# EAGLE board ESP32-P4 Display 7.0 inch V1.2 (EAGLE 9.6.2), part 1 of 3
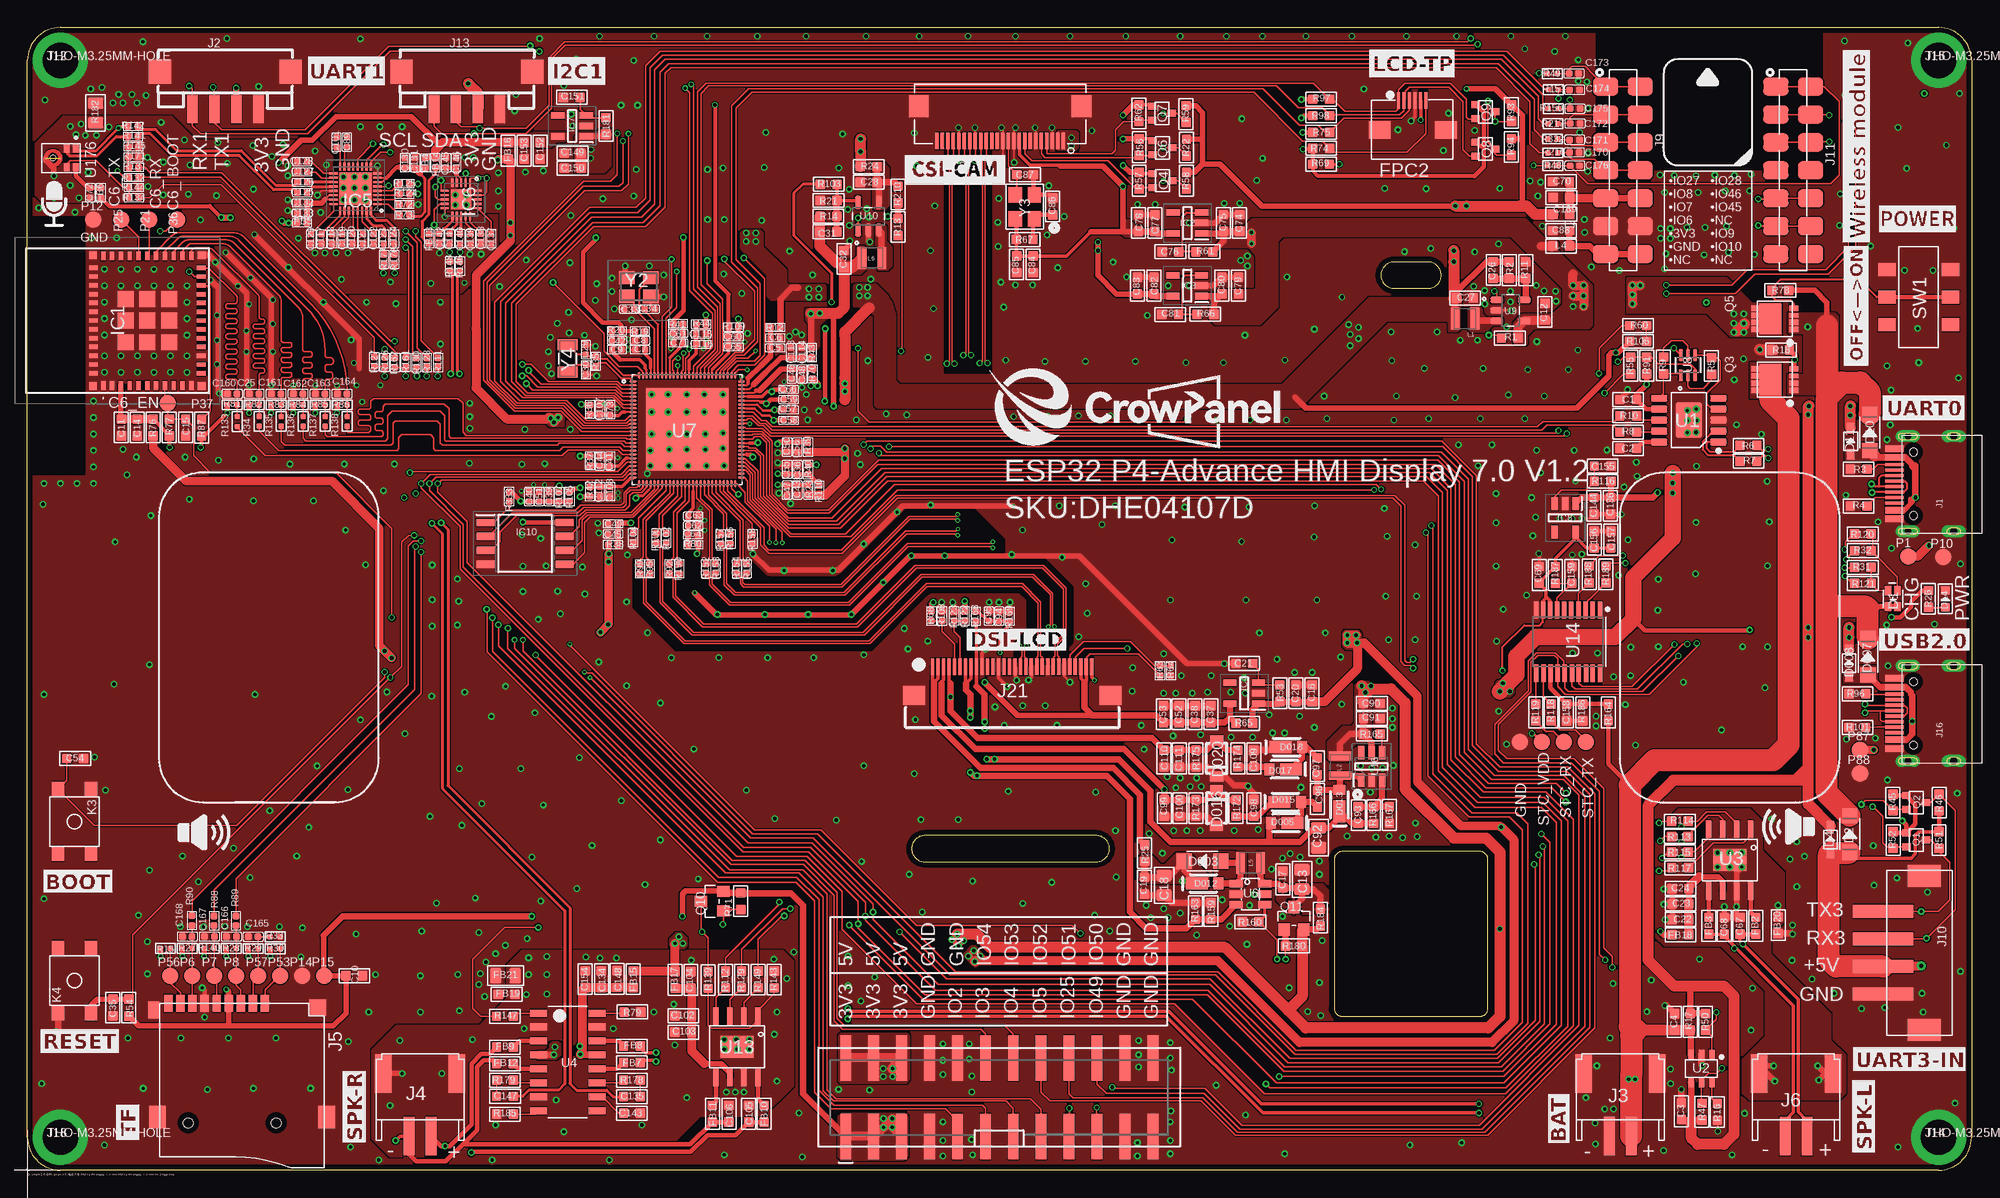
[diagram p9: board, top side]
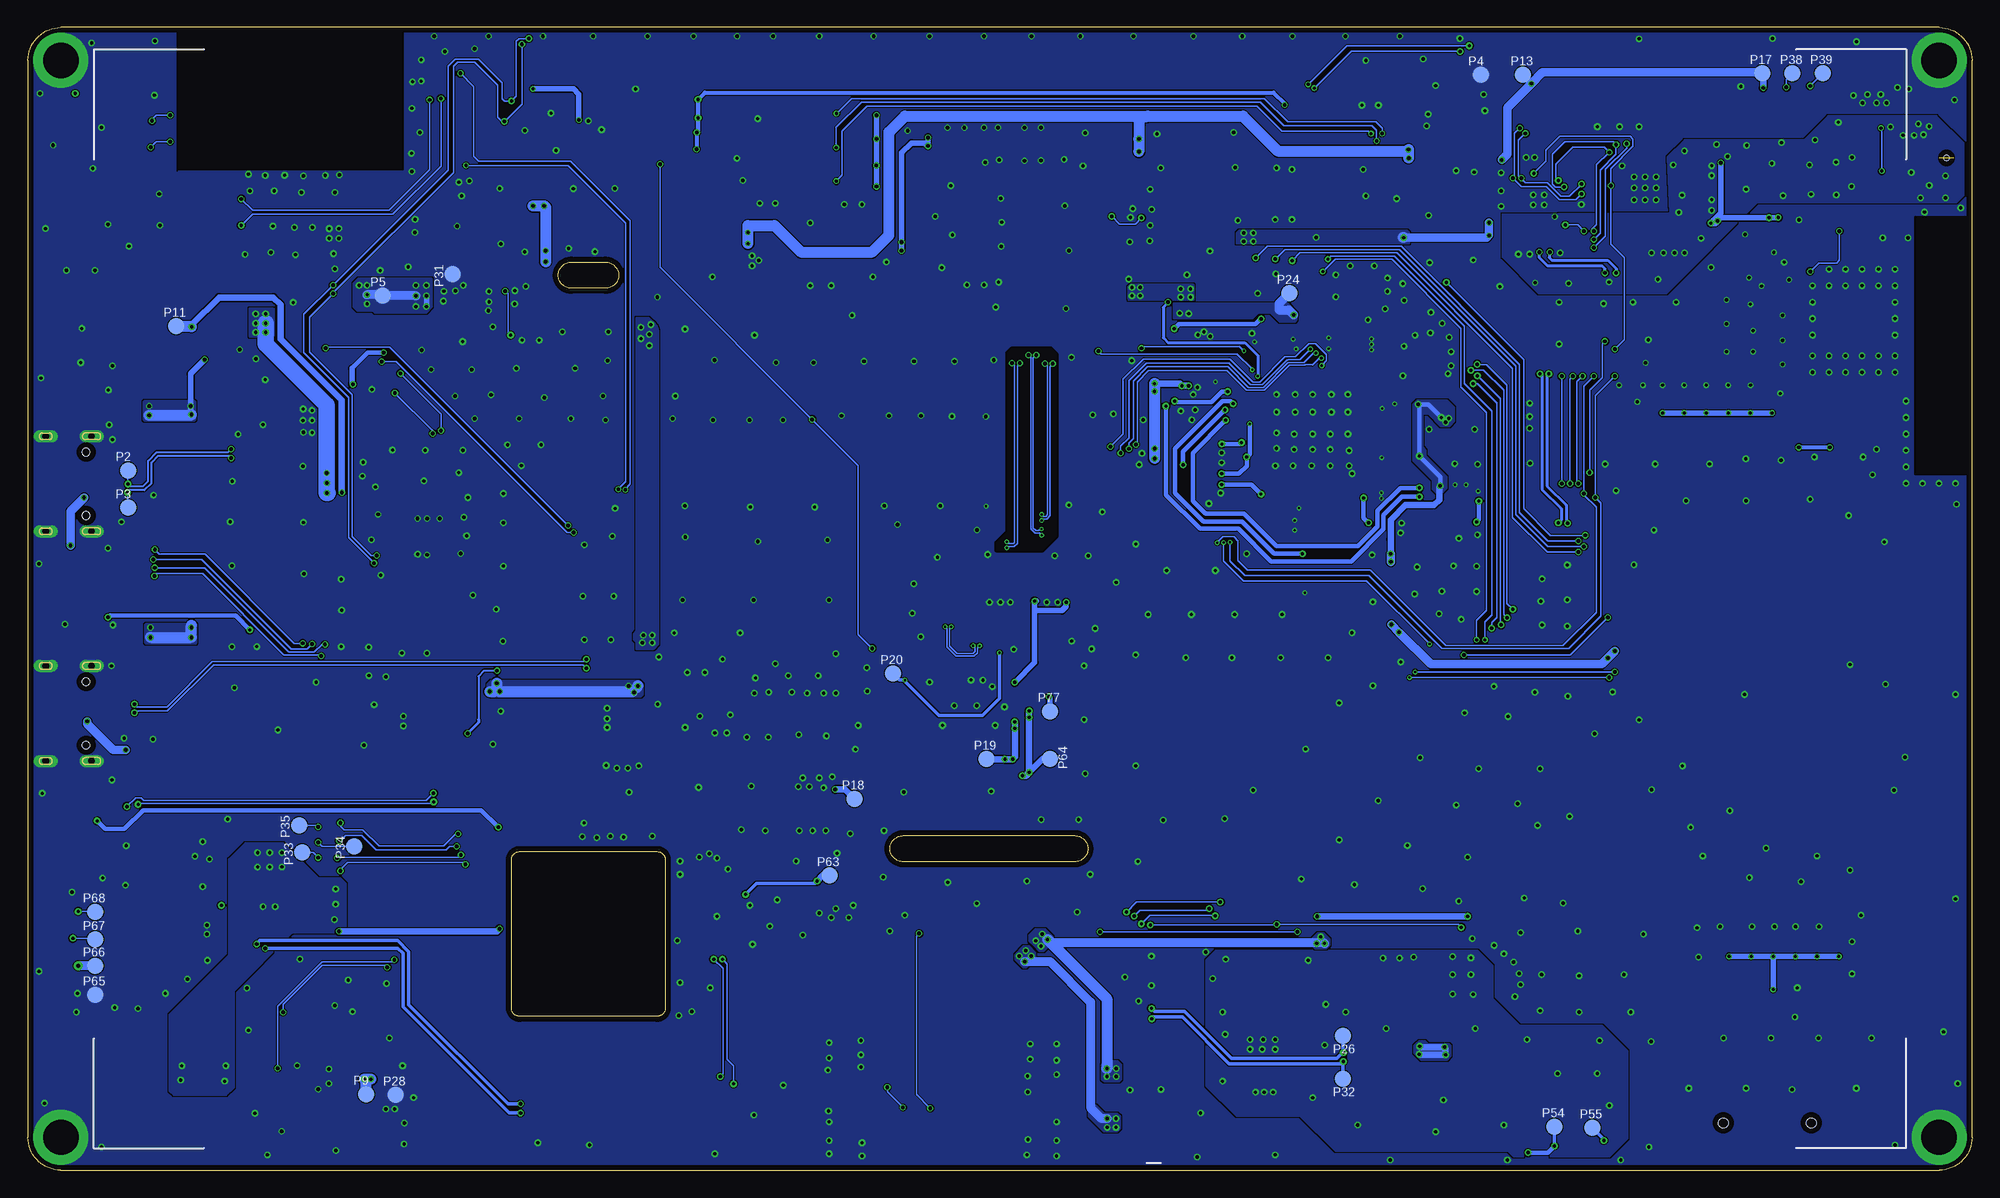
[diagram p10: board, bottom side, seen from below]

Size 176.9 x 104 mm. Coordinates in mm from the lower left corner, seen from the top.
Outline: 0,3 0,101 arc-90 3,104 173.9,104 arc-90 176.9,101 176.9,3 arc-90 173.9,0 3,0 arc-90 0,3
Outline: 81.64,28.07 97.27,28.07 arc180 97.27,30.45 81.64,30.45 arc180 81.64,28.07
Outline: 124.34,80.27 127.46,80.27 arc180 127.46,82.64 124.34,82.64 arc180 124.34,80.27
Outline: 119.65,14 132.15,14 arc90 132.9,14.75 132.9,28.25 arc90 132.15,29 119.65,29 arc90 118.9,28.25 118.9,14.75 arc90 119.65,14
Copper layers (1*16): Top 0.035mm / dielectric 1.5mm / Bottom 0.035mm
Design rules "default *": minimum track width 4mil, minimum drill 0.2mm, track to track 4mil, track to pad 6mil, pad to pad 6mil, via to via 6mil, smd to smd 6mil, copper to edge 20mil, drill to drill 6mil, minimum pad ring 10mil, minimum via ring 4mil, stop-mask expansion 4mil, vias tented up to drill 100mil, thermal gap 10mil

## Footprints (pad centres in the part's own frame; a part is rotated, then mirrored left to right if it is on the bottom)
0603 = smd 0.889 x 0.889: 1 -0.762,0; 2 0.762,0
C0402 = smd 0.6 x 0.6: 1 -0.45,0; 2 0.45,0
DISCRETE-NEW_C0603 = smd 0.889 x 0.889: 1 0,0.762; 2 0,-0.762
C0805 = smd 1.016 x 1.397: 1 -0.889,0; 2 0.889,0
C0402' = smd 0.635 x 0.635: 1 0,0.445; 2 0,-0.445
LED_KT-0603RYG = smd 0.85 x 0.6: 1 0.725,-0.425; 2 0.725,0.425; 3 -0.725,-0.425; 4 -0.725,0.425
D_SOD123FL = smd 1.397 x 1.397: + -1.651,0; - 1.651,0
D_SOD323 = smd 1 x 0.8: + -1.2,0; - 1.2,0
LMBR140ET1G = smd 2 x 1.1: 1 -0.975,0 | smd 0.9 x 1.1: 2 0.975,0
LED0603 = smd 0.762 x 0.889: + -0.762,0; - 0.762,0
LMSZ5233BT1G = smd 0.91 x 1.22: 1 -1.635,0; 2 1.635,0
L0603 = smd 0.889 x 0.889: 1 -0.762,0; 2 0.762,0
L0402 = smd 0.635 x 0.635: 1 -0.445,0; 2 0.445,0
R0402 = smd 0.635 x 0.635: 1 -0.445,0; 2 0.445,0
L0805 = smd 1.016 x 1.397: 1 -0.889,0; 2 0.889,0
FPC-6PIN-0.5MM = smd 0.3 x 1.5: 1 -1.31,2.184; 2 -0.81,2.184; 3 -0.31,2.184; 4 0.19,2.184; 5 0.69,2.184; 6 1.19,2.184 | smd 2 x 1.6: 7 -3.01,-0.496; 8 3.036,-0.496
FPC-SMD_P0.50-24P_QCHF-SM-H2.0 = smd 0.3 x 1.5: 1 5.75,-1.574; 2 5.25,-1.574; 3 4.75,-1.574; 4 4.25,-1.574; 5 3.75,-1.574; 6 3.25,-1.574; 7 2.75,-1.574; 8 2.25,-1.574; 9 1.75,-1.574; 10 1.25,-1.574; 11 0.75,-1.574; 12 0.25,-1.574; 13 -0.25,-1.574; 14 -0.75,-1.574; 15 -1.25,-1.574; 16 -1.75,-1.574; 17 -2.25,-1.574; 18 -2.75,-1.574; 19 -3.25,-1.574; 20 -3.75,-1.574; 21 -4.25,-1.574; 22 -4.75,-1.574; 23 -5.25,-1.574; 24 -5.75,-1.574 | smd 1.8 x 2: 25 7.4,1.576; 26 -7.4,1.576
ESP32C6MINI1N4 = smd 0.8 x 0.4: 1 -5.9,4; 2 -5.9,3.2; 3 -5.9,2.4; 4 -5.9,1.6; 5 -5.9,0.8; 6 -5.9,0; 7 -5.9,-0.8; 8 -5.9,-1.6; 9 -5.9,-2.4; 10 -5.9,-3.2; 11 -5.9,-4; 25 5.9,-4; 26 5.9,-3.2; 27 5.9,-2.4; 28 5.9,-1.6; 29 5.9,-0.8; 30 5.9,0; 31 5.9,0.8; 32 5.9,1.6; 33 5.9,2.4; 34 5.9,3.2; 35 5.9,4 | smd 0.4 x 0.8: 12 -4.8,-4.9; 13 -4,-4.9; 14 -3.2,-4.9; 15 -2.4,-4.9; 16 -1.6,-4.9; 17 -0.8,-4.9; 18 0,-4.9; 19 0.8,-4.9; 20 1.6,-4.9; 21 2.4,-4.9; 22 3.2,-4.9; 23 4,-4.9; 24 4.8,-4.9; 36 4.8,4.9; 37 4,4.9; 38 3.2,4.9; 39 2.4,4.9; 40 1.6,4.9; 41 0.8,4.9; 42 0,4.9; 43 -0.8,4.9; 44 -1.6,4.9; 45 -2.4,4.9; 46 -3.2,4.9; 47 -4,4.9; 48 -4.8,4.9 | smd 1.45 x 1.45: 49 0,0; 54 -1.975,1.975; 55 -1.975,0; 56 -1.975,-1.975; 57 0,-1.975; 58 1.975,-1.975; 59 1.975,0; 60 1.975,1.975; 61 0,1.975 | smd 0.7 x 0.7: 50 5.95,4.95; 51 5.95,-4.95; 52 -5.95,-4.95; 53 -5.95,4.95
SOT95P282X145-5N = smd 1.2 x 0.6: 1 -1.3,0.95; 2 -1.3,0; 3 -1.3,-0.95; 4 1.3,-0.95; 5 1.3,0.95
QFN40P400X400X80-33N = smd 0.75 x 0.2: 1 -2,1.4; 2 -2,1; 3 -2,0.6; 4 -2,0.2; 5 -2,-0.2; 6 -2,-0.6; 7 -2,-1; 8 -2,-1.4; 17 2,-1.4; 18 2,-1; 19 2,-0.6; 20 2,-0.2; 21 2,0.2; 22 2,0.6; 23 2,1; 24 2,1.4 | smd 0.2 x 0.75: 9 -1.4,-2; 10 -1,-2; 11 -0.6,-2; 12 -0.2,-2; 13 0.2,-2; 14 0.6,-2; 15 1,-2; 16 1.4,-2; 25 1.4,2; 26 1,2; 27 0.6,2; 28 0.2,2; 29 -0.2,2; 30 -0.6,2; 31 -1,2; 32 -1.4,2 | smd 2.9 x 2.9: 33 0,0
QFN40P300X300X60-21N = smd 0.75 x 0.2: 1 -1.5,0.8; 2 -1.5,0.4; 3 -1.5,0; 4 -1.5,-0.4; 5 -1.5,-0.8; 11 1.5,-0.8; 12 1.5,-0.4; 13 1.5,0; 14 1.5,0.4; 15 1.5,0.8 | smd 0.2 x 0.75: 6 -0.8,-1.5; 7 -0.4,-1.5; 8 0,-1.5; 9 0.4,-1.5; 10 0.8,-1.5; 16 0.8,1.5; 17 0.4,1.5; 18 0,1.5; 19 -0.4,1.5; 20 -0.8,1.5 | smd 1.8 x 1.8: 21 0,0
SOIC127P790X216-8N = smd 1.65 x 0.65: 1 -3.6,1.905; 2 -3.6,0.635; 3 -3.6,-0.635; 4 -3.6,-1.905; 5 3.6,-1.905; 6 3.6,-0.635; 7 3.6,0.635; 8 3.6,1.905
USB-3.0TYPEC-SMD = smd 0.3 x 1.7: A1 -3.35,0.5; A4 -2.55,0.5; A5 -1.25,0.5; A6 -0.25,0.5; A7 0.25,0.5; A8 1.25,0.5; A9 2.55,0.5; A12 3.35,0.5; B1 3.05,0.5; B4 2.25,0.5; B5 1.75,0.5; B6 0.75,0.5; B7 -0.75,0.5; B8 -1.75,0.5; B9 -2.25,0.5; B12 -3.05,0.5 | drill 0.6 pad 1.016 long: P$1 -4.325,-0.72; P$2 4.325,-0.72; P$3 -4.325,-4.9; P$4 4.325,-4.9 | hole 0.68: -2.89,-1.22; 2.89,-1.22
CONNECTOR_4P-SMD-2.0 = smd 0.965 x 2.54: 1 -3,0; 2 -1,0; 3 1,0; 4 3,0 | smd 2.032 x 2.184: SS1 -5.946,3.4; SS2 5.946,3.4
PH2.0WT-2PIN = smd 1 x 3.5: P$1 -1,0; P$2 1,0 | smd 1.5 x 3.5: P$3 -3.35,-5.7; P$4 3.35,-5.7
9P-SMD-W/-RING = smd 1.524 x 0.762: 1 0,4.4; 2 0,3.3; 3 0,2.2; 4 0,1.1; 5 0,0; 6 0,-1.1; 7 0,-2.2; 8 0,-3.3; 9 0,-4.4 | smd 1.524 x 1.016: G1 0.6,-5.746 | smd 2.032 x 1.524: G2 10.373,-5.4; G3 10.373,10 | smd 1.524 x 1.524: G4 0.392,9.181 | hole 0.889: 10.9,-2.6; 10.9,5.4
2X12-SMD1 = smd 4.14 x 0.991: 1 -3.569,13.97; 2 3.569,13.97; 3 -3.569,11.43; 4 3.569,11.43; 5 -3.569,8.89; 6 3.569,8.89; 7 -3.569,6.35; 8 3.569,6.35; 9 -3.569,3.81; 10 3.569,3.81; 11 -3.569,1.27; 12 3.569,1.27; 13 -3.569,-1.27; 14 3.569,-1.27; 15 -3.569,-3.81; 16 3.569,-3.81; 17 -3.569,-6.35; 18 3.569,-6.35; 19 -3.569,-8.89; 20 3.569,-8.89; 21 -3.569,-11.43; 22 3.569,-11.43; 23 -3.569,-13.97; 24 3.569,-13.97
TEST-PIN-4-2.0MM = smd 1.5 x 1.5: 1 -3,0; 2 -1,0; 3 1,0; 4 3,0
H7-2.54-18.28X2.5X5MM = smd 1.65 x 2.3: 1 -7.62,-1.58; 1-1 -7.62,1.58; 2 -5.08,-1.58; 2-2 -5.08,1.58; 3 -2.54,-1.58; 3-3 -2.54,1.58; 4 0,-1.58; 4-4 0,1.58; 5 2.54,-1.58; 5-5 2.54,1.58; 6 5.08,-1.58; 6-6 5.08,1.58; 7 7.62,-1.58; 7-7 7.62,1.58
XH2.54-4P-SMD = smd 1.2 x 5.5: 1 -3.75,-1.875; 2 -1.25,-1.875; 3 1.25,-1.875; 4 3.75,-1.875 | smd 2 x 3: 5 -7,1.875; 6 7,1.875
THO-M3.2*5MM-HOLE = drill 3.2 pad 5: P$1 0,0
C23398852_30P_0.5MM_下接_FC-05A30P11H20 = smd 0.3 x 1.5: 1 -7.25,1.3; 2 -6.75,1.3; 3 -6.25,1.3; 4 -5.75,1.3; 5 -5.25,1.3; 6 -4.75,1.3; 7 -4.25,1.3; 8 -3.75,1.3; 9 -3.25,1.3; 10 -2.75,1.3; 11 -2.25,1.3; 12 -1.75,1.3; 13 -1.25,1.3; 14 -0.75,1.3; 15 -0.25,1.3; 16 0.25,1.3; 17 0.75,1.3; 18 1.25,1.3; 19 1.75,1.3; 20 2.25,1.3; 21 2.75,1.3; 22 3.25,1.3; 23 3.75,1.3; 24 4.25,1.3; 25 4.75,1.3; 26 5.25,1.3; 27 5.75,1.3; 28 6.25,1.3; 29 6.75,1.3; 30 7.25,1.3 | smd 2 x 1.7: 31 8.95,-1.3; 32 -8.95,-1.3
KEY-4.5X4.5-SMD = smd 1.35 x 1.1: 1 -2.925,1.5; 2 -2.925,-1.5; 3 2.925,-1.5; 4 2.925,1.5
1008(2520) = smd 0.8 x 2: 1 -0.9,0; 2 0.9,0
TEST_PAD-1.5MM = smd 1.5 x 1.5: P$1 0,0
MOS_SOT323 = smd 0.635 x 0.762: 1 -0.635,-0.889; 2 0.635,-0.889; 3 0,0.889
PDFN3333 = smd 0.5 x 0.8: 1 -0.975,-1.725; 2 -0.325,-1.725; 4 0.975,-1.725; 5 0.975,1.725; 6 0.325,1.725; 7 -0.325,1.725; 8 -0.975,1.725 | smd 0.4 x 0.8: 3 0.325,-1.725 | smd 2.8 x 2: 9 0,0.4
PMOS_SOT23 = smd 1.016 x 1.143: 1 -0.889,-1.016; 2 0.889,-1.016; 3 0,1.016
R0603@1 = smd 0.889 x 0.889: 1 -0.762,0; 2 0.762,0
R0603 = smd 0.889 x 0.889: 1 -0.762,0; 2 0.762,0
0402 = smd 0.5 x 0.5: 1 -0.45,0; 2 0.45,0
R0603-SP = smd 0.889 x 0.889: 1 -0.762,0; 2 0.762,0
SWITCH_6PIN_2P = smd 1.2 x 1.6: 1 2.5,-2.9; 2 0,-2.9; 3 -2.5,-2.9; 4 -2.5,2.9; 5 0,2.9; 6 2.5,2.9
ESOP-10-EP-150MIL = smd 1.5 x 0.6: 1 -2.7,2; 2 -2.7,1; 3 -2.7,0; 4 -2.7,-1; 5 -2.7,-2; 6 2.7,-2; 7 2.7,-1; 8 2.7,0; 9 2.7,1; 10 2.7,2 | smd 2.4 x 3.2: EP 0,0
SOT23-6L = smd 0.5 x 0.9: 1 -0.961,-1.212; 2 -0.011,-1.212; 3 0.94,-1.212; 4 0.94,1.288; 5 -0.011,1.288; 6 -0.961,1.288
NS4168-ESOP-8 = smd 1.6 x 0.5: 1 -2.8,1.905; 2 -2.8,0.635; 3 -2.8,-0.635; 4 -2.8,-1.905; 5 2.8,-1.905; 6 2.8,-0.635; 7 2.8,0.635; 8 2.8,1.905 | smd 2 x 3: 9 0,0
SOP16 = smd 0.635 x 1.524: 1 0,0; 2 1.27,0; 3 2.54,0; 4 3.81,0; 5 5.08,0; 6 6.35,0; 7 7.62,0; 8 8.89,0; 9 8.89,5.334; 10 7.62,5.334; 11 6.35,5.334; 12 5.08,5.334; 13 3.81,5.334; 14 2.54,5.334; 15 1.27,5.334; 16 0,5.334
COOPER_SOT23-6 = smd 0.69 x 1.2: 1 -0.95,-1.3; 2 0,-1.3; 3 0.95,-1.3; 4 0.95,1.3; 5 0,1.3; 6 -0.95,1.3
IC_ESP32-P4NRW32 = smd 0.65 x 0.18: 1 -4.925,4.375; 2 -4.925,4.025; 3 -4.925,3.675; 4 -4.925,3.325; 5 -4.925,2.975; 6 -4.925,2.625; 7 -4.925,2.275; 8 -4.925,1.925; 9 -4.925,1.575; 10 -4.925,1.225; 11 -4.925,0.875; 12 -4.925,0.525; 13 -4.925,0.175; 14 -4.925,-0.175; 15 -4.925,-0.525; 16 -4.925,-0.875; 17 -4.925,-1.225; 18 -4.925,-1.575; 19 -4.925,-1.925; 20 -4.925,-2.275; 21 -4.925,-2.625; 22 -4.925,-2.975; 23 -4.925,-3.325; 24 -4.925,-3.675; 25 -4.925,-4.025; 26 -4.925,-4.375; 53 4.925,-4.375; 54 4.925,-4.025; 55 4.925,-3.675; 56 4.925,-3.325; 57 4.925,-2.975; 58 4.925,-2.625; 59 4.925,-2.275; 60 4.925,-1.925; 61 4.925,-1.575; 62 4.925,-1.225; 63 4.925,-0.875; 64 4.925,-0.525; 65 4.925,-0.175; 66 4.925,0.175; 67 4.925,0.525; 68 4.925,0.875; 69 4.925,1.225; 70 4.925,1.575; 71 4.925,1.925; 72 4.925,2.275; 73 4.925,2.625; 74 4.925,2.975; 75 4.925,3.325; 76 4.925,3.675; 77 4.925,4.025; 78 4.925,4.375 | smd 0.18 x 0.65: 27 -4.375,-4.925; 28 -4.025,-4.925; 29 -3.675,-4.925; 30 -3.325,-4.925; 31 -2.975,-4.925; 32 -2.625,-4.925; 33 -2.275,-4.925; 34 -1.925,-4.925; 35 -1.575,-4.925; 36 -1.225,-4.925; 37 -0.875,-4.925; 38 -0.525,-4.925; 39 -0.175,-4.925; 40 0.175,-4.925; 41 0.525,-4.925; 42 0.875,-4.925; 43 1.225,-4.925; 44 1.575,-4.925; 45 1.925,-4.925; 46 2.275,-4.925; 47 2.625,-4.925; 48 2.975,-4.925; 49 3.325,-4.925; 50 3.675,-4.925; 51 4.025,-4.925; 52 4.375,-4.925; 79 4.375,4.925; 80 4.025,4.925; 81 3.675,4.925; 82 3.325,4.925; 83 2.975,4.925; 84 2.625,4.925; 85 2.275,4.925; 86 1.925,4.925; 87 1.575,4.925; 88 1.225,4.925; 89 0.875,4.925; 90 0.525,4.925; 91 0.175,4.925; 92 -0.175,4.925; 93 -0.525,4.925; 94 -0.875,4.925; 95 -1.225,4.925; 96 -1.575,4.925; 97 -1.925,4.925; 98 -2.275,4.925; 99 -2.625,4.925; 100 -2.975,4.925; 101 -3.325,4.925; 102 -3.675,4.925; 103 -4.025,4.925; 104 -4.375,4.925 | smd 7.5 x 7.5: 105 0,0
SOP65P210X100-6N = smd 1.09 x 0.4: 1 -0.92,0.65; 2 -0.92,0; 3 -0.92,-0.65; 4 0.92,-0.65; 5 0.92,0; 6 0.92,0.65
SOT95P280X145-5N = smd 1.21 x 0.59: 1 -1.255,0.95; 2 -1.255,0; 3 -1.255,-0.95; 4 1.255,-0.95; 5 1.255,0.95
TSSOP20 = smd 1.572 x 0.41: 1 -2.872,2.275; 2 -2.872,1.625; 3 -2.872,0.975; 4 -2.872,0.325; 5 -2.872,-0.325; 6 -2.872,-0.975; 7 -2.872,-1.625; 8 -2.872,-2.275; 9 -2.872,-2.895; 10 -2.872,-3.545; 11 2.872,-3.515; 12 2.872,-2.865; 13 2.872,-2.215; 14 2.872,-1.565; 15 2.872,-0.915; 16 2.872,-0.265; 17 2.872,0.355; 18 2.872,1.005; 19 2.872,1.625; 20 2.872,2.275
SOT95P280X145-6N = smd 1.2 x 0.6: 1 -1.25,0.95; 2 -1.25,0; 3 -1.25,-0.95; 4 1.25,-0.95; 5 1.25,0; 6 1.25,0.95
MIC-SMD_5P-L3.5-W2.7-P1.67 = smd 0.725 x 0.522: 1 -0.838,1.362; 2 -0.838,0.542; 3 0.838,0.542; 4 0.838,1.362 | smd 0.25 x 0.25: 5_1 0,-0.048; 5_2 0,-1.373 | hole 0.5: 0,-0.71
X322540MPB4SI = smd 1.4 x 1.2: 1 -1.1,-0.85; 2 1.1,-0.85; 3 1.1,0.85; 4 -1.1,0.85
24MHZ_1631-24003-BTKEYA = smd 1.4 x 1.2: 1 -1.1,-0.875; 2 1.1,-0.875; 3 1.1,0.875; 4 -1.1,0.875
NORDIC_NRF_XTAL_3215_N = smd 1 x 1.8: 1 -1.25,0; 2 1.25,0

## Placement (x,y rotation side)
C1  1uF  [0603]  145.65,70.14 0 top
C2  1uF  [0603]  145.65,65.69 0 top
C3  1uF  [0603]  150.49,5.37 270 top
C4  10uF/NC  [0603]  149.86,13.51 270 top
C5  100nF  [C0402]  68.03,74.84 0 top
C6  10uF  [C0402]  68.05,75.75 180 top
C7  100nF  [C0402]  55.74,74.68 180 top
C8  10uF  [C0402]  55.74,75.51 0 top
C9  100nF  [C0402]  53.63,74.68 0 top
C10  1uF  [DISCRETE-NEW_C0603]  29.74,17.7 270 top
C11  100nF  [0603]  8.55,67.6 270 top
C12  10uF/10V+  [0603]  138.08,78.13 90 top
C13  22uF  [C0805]  115.97,26.46 90 top
C14  10uF  [0603]  9.98,67.6 90 top
C15  100nF  [0603]  14.4,67.6 270 top
C16  10uF  [0603]  116.89,43.4 270 top
C17  1uF  [0603]  114.22,26.46 270 top
C18  22uF  [C0805]  103.43,25.92 270 top
C19  100nF  [0603]  101.64,25.89 270 top
C20  100nF  [0603]  115.42,43.4 270 top
C21  100nF  [0603]  110.72,46.12 0 top
C22  1uF  [0603]  150.41,22.81 180 top
C23  47uF  [0603]  150.41,24.24 180 top
C24  47uF  [0603]  150.41,25.64 180 top
C25  10pF_NC  [C0402']  20.63,70.66 90 top
C26  22pF  [0603]  133.37,81.93 90 top
C27  10uF/10V+  [0603]  130.81,79.39 180 top
C28  10uF/10V+  [0603]  76.54,89.9 180 top
C29  12pF  [C0402]  50.81,74.68 90 top
C30  12pF  [C0402]  50.82,72.84 270 top
C31  22pF  [0603]  72.87,85.4 180 top
C32  10uF/10V+  [0603]  74.28,82.93 270 top
C33  15pF  [C0402]  54.76,78.36 180 top
C34  15pF  [C0402]  56.6,78.36 180 top
C35  100nF  [0603]  7.77,14.81 90 top
C36  100nF  [C0402]  70.06,63.78 90 top
C37  100nF  [0603]  107.68,41.5 270 top
C38  10uF  [0603]  106.24,41.5 270 top
C39  100nF_NC  [C0402]  47.46,61.3 90 top
C40  100nF  [C0402]  45.66,61.3 90 top
C41  100nF  [C0402]  53.03,64.55 90 top
C42  10uF  [C0402]  53.63,75.53 180 top
C43  100nF  [C0402]  70.06,61.9 270 top
C44  10uF  [C0402]  52.09,64.55 270 top
C45  100nF  [C0402]  53.28,57.91 180 top
C46  100nF  [C0402]  69.56,72.47 270 top
C47  10uF  [C0402]  69.12,61.9 90 top
C48  10uF  [C0402]  70.49,72.47 90 top
C49  10uF  [C0402]  53.28,58.82 0 top
C50  100nF  [C0402]  69.12,65.81 270 top
C51  1uF  [C0402]  46.56,61.3 90 top
C52  100nF  [0603]  104.8,41.5 270 top
C53  100nF  [0603]  103.36,41.5 270 top
C54  100nF  [0603]  4.34,37.47 180 top
C55  1uF  [C0402]  69.12,63.79 90 top
C56  10uF  [C0402]  70.06,65.81 90 top
C57  1uF  [C0402]  69.27,69.2 0 top
C58  1uF  [C0402]  69.27,68.25 0 top
C59  1uF  [C0402]  69.26,70.14 0 top
C60  100nF  [C0402]  64.24,75.85 0 top
C61  100nF  [C0402]  59.19,76.16 180 top
C62  10nF  [C0402]  60.57,58.66 0 top
C63  100nF  [C0402]  60.57,59.52 0 top
C64  1uF  [C0402]  60.56,57.82 0 top
C65  1uF  [C0402]  64.24,74.93 0 top
C66  1uF  [C0402]  69.26,71.06 0 top
C67  1nF  [0603]  155.82,22.25 270 top
C68  1nF  [0603]  154.4,22.25 270 top
C69  1uF  [0603]  137.55,54.18 270 top
C70  10UF  [0603]  139.53,89.97 180 top
C71  10uF  [C0402]  59.19,75.3 0 top
C72  100nF  [C0402]  5.71,88.95 90 top
C73  100nF  [C0402]  53.03,69.23 90 top
C74  10uF  [0603]  110.3,86.2 270 top
C75  100nF  [0603]  108.83,86.2 270 top
C76  100nF  [0603]  104.01,83.58 0 top
C77  100nF  [0603]  102.59,86.2 270 top
C78  10uF  [0603]  101.1,86.2 270 top
C79  10uF  [0603]  110.2,80.5 270 top
C80  100nF  [0603]  108.69,80.5 270 top
C81  100nF  [0603]  103.98,77.88 0 top
C82  100nF  [0603]  102.5,80.5 270 top
C83  10uF  [0603]  101,80.5 270 top
C84  100nF  [0603]  91.51,82.44 90 top
C85  1nF  [0603]  90.01,82.44 90 top
C86  1uF  [0603]  93.29,87.72 270 top
C87  15pF  [0603]  90.77,90.61 180 top
C88  10UF_NC  [0603]  139.55,85.52 180 top
C89  22pF_NC  [C0402]  29.07,93.56 90 top
C90  10uF/25V  [0603]  122.33,42.48 0 top
C91  100nF/50V  [0603]  122.33,41.11 0 top
C92  22uF/16V  [C0805]  117.48,30.26 270 top
C93  10nF/25V  [0603]  121.09,32.32 90 top
C94  10uF/25V  [C0402]  88.42,50.42 90 top
C95  100nF/50V  [C0402]  87.49,50.42 90 top
C96  1uF/25V  [0603]  117.38,33.8 270 top
C97  1uF/25V  [0603]  117.37,36.76 90 top
C98  1uF/50V  [0603]  111.59,32.96 90 top
C99  10uF/25V  [0603]  103.45,32.96 270 top
C100  100nF/50V  [0603]  104.87,32.96 270 top
C101  22pF_NC  [C0402]  28.12,93.56 90 top
C102  1uF  [0603]  59.67,14.06 180 top
C103  47uF  [0603]  59.67,12.56 180 top
C104  47uF  [0603]  60.36,17.33 90 top
C105  1nF  [0603]  65.62,5.15 270 top
C106  1nF  [0603]  63.83,5.15 270 top
C107  10uF  [C0402]  52.09,69.23 270 top
C108  100nF  [C0402]  53.03,61.77 270 top
C109  1uF/50V  [0603]  111.58,37.47 90 top
C110  10uF/25V  [0603]  103.41,37.47 270 top
C111  100nF/50V  [0603]  104.81,37.47 270 top
C112  10uF  [C0402]  52.09,61.77 90 top
C113  100nF  [C0402]  69.49,74.42 90 top
C114  10uF  [C0402]  70.43,74.42 270 top
C115  100nF  [C0402]  61.29,76.09 0 top
C116  10uF  [C0402]  61.3,75.17 180 top
C117  1uF_NC  [C0402]  26.76,84.76 90 top
C118  1uF_NC  [C0402]  27.71,84.76 90 top
C119  1uF_NC  [C0402]  28.65,84.76 90 top
C120  1uF_NC  [C0402]  29.6,84.76 90 top
C121  1uF_NC  [C0402]  30.54,84.76 90 top
C122  1uF_NC  [C0402]  31.49,84.76 90 top
C123  1uF_NC  [C0402]  32.43,84.76 90 top
C124  1uF_NC  [C0402]  33.38,84.76 90 top
C125  1uF_NC  [C0402]  25,88.96 180 top
C126  1uF_NC  [C0402]  25,89.91 180 top
C127  1uF_NC  [C0402]  25,90.85 180 top
C128  1uF_NC  [C0402]  25,91.8 180 top
C129  1uF_NC  [C0402]  25.81,84.76 270 top
C130  100nF_NC  [C0402]  34.35,91.7 90 top
C131  1uF_NC  [C0402]  35.28,91.68 270 top
C132  100nF_NC  [C0402]  24.99,88.03 180 top
C133  1uF_NC  [C0402]  24.98,87.12 0 top
C134  47uF_NC  [0603]  52.23,17.39 270 top
C135  100nF_NC  [0603]  55,6.7 0 top
C136  10uF  [0603]  144.05,60.46 90 top
C137  1uF_NC  [C0402]  42.21,84.77 90 top
C138  1uF_NC  [C0402]  41.26,84.78 270 top
C139  1uF_NC  [C0402]  40.31,84.78 270 top
C140  1uF_NC  [C0402]  39.37,84.78 270 top
C141  1uF_NC  [C0402]  38.42,84.78 270 top
C142  1uF_NC  [C0402]  37.48,84.78 270 top
C143  1uF_NC  [0603]  55,5.2 180 top
C144  100nF  [0603]  142.53,60.46 90 top
C145  100nF_NC  [C0402]  38.09,91.69 90 top
C146  1uF_NC  [C0402]  39.01,91.71 270 top
C147  100nF_NC  [0603]  43.45,6.72 180 top
C148  47uF_NC  [0603]  53.65,17.41 270 top
C149  10uF  [0603]  49.61,92.56 0 top
C150  100nF  [0603]  49.61,91.2 0 top
C151  100nF  [0603]  49.53,97.64 0 top
C152  100nF  [0603]  46.65,92.79 90 top
C153  10uF  [0603]  45.2,92.79 90 top
C154  100nF_NC  [0603]  50.75,17.39 90 top
C155  100nF  [0603]  143.33,64.09 180 top
C156  100nF  [0603]  142.56,57.39 270 top
C157  10uF  [0603]  144.08,57.39 270 top
C158  1nF  [0603]  140.04,41.66 90 top
C159  100nF  [0603]  140.52,54.18 270 top
C160  10pF_NC  [C0402']  18.63,70.66 90 top
C161  10pF_NC  [C0402']  22.63,70.66 90 top
C162  10pF_NC  [C0402']  24.63,70.66 90 top
C163  10pF_NC  [C0402']  26.63,70.66 90 top
C164  10pF_NC  [C0402']  28.63,70.66 90 top
C165  10pF_NC  [C0402']  20.54,21.24 90 top
C166  10pF_NC  [C0402']  18.55,21.26 90 top
C167  10pF_NC  [C0402']  16.55,21.25 90 top
C168  10pF_NC  [C0402']  14.54,21.26 90 top
C169  100nF  [0603]  139.57,88.52 180 top
C170  NC  [C0402']  140.75,92.63 270 top
C171  NC  [C0402']  140.79,93.79 270 top
C172  NC  [C0402']  140.81,95.28 270 top
C173  NC  [C0402']  140.72,99.82 270 top
C174  NC  [C0402']  140.79,98.33 270 top
C175  NC  [C0402']  140.81,96.61 270 top
C176  NC  [C0402']  140.8,91.42 270 top
D1  KT-0603RYG  [LED_KT-0603RYG]  169.74,52.03 270 top
D2  DSS34  [D_SOD123FL]  165.81,30.6 90 top
D003  NC/DSS34  [D_SOD123FL]  106.91,28.12 180 top
D4  1N5817WS  [D_SOD323]  164.06,30.09 90 top
D005  LMBR140ET1G  [LMBR140ET1G]  114.11,31.61 180 top
D007  DSS34  [D_SOD123FL]  167.47,46.72 90 top
D008  1N5817WS  [D_SOD323]  165.75,46.15 90 top
D10  DSS34  [D_SOD123FL]  167.63,67.14 90 top
D11  1N5817WS  [D_SOD323]  165.9,66.35 90 top
D012  LMBR140ET1G  [LMBR140ET1G]  107.41,26.09 0 top
D013  LMBR140ET1G  [LMBR140ET1G]  119.39,33.65 90 top
D14  Red  [LED0603]  174.52,52 90 top
D015  LMBR140ET1G  [LMBR140ET1G]  114.89,33.51 0 top
D016  MM1W18_18V  [LMSZ5233BT1G]  108.19,32.96 270 top
D017  LMBR140ET1G  [LMBR140ET1G]  113.99,36.49 180 top
D018  LMBR140ET1G  [LMBR140ET1G]  114.99,38.51 0 top
D020  LMSZ5233BT1G_-6V  [LMSZ5233BT1G]  108.21,37.47 90 top
FB2  1K/磁珠  [L0603]  157.27,22.25 270 top
FB3  1K/磁珠  [L0603]  152.99,22.25 270 top
FB4  0R/800mA_NC  [L0402]  36.21,91.67 270 top
FB5  0R/800mA_NC  [L0402]  24.97,86.21 0 top
FB6  0R/800mA  [L0402]  6.67,88.97 90 top
FB7  1K/磁珠_NC  [L0603]  55,9.8 0 top
FB8  1K/磁珠_NC  [L0603]  55,11.3 0 top
FB9  1K/磁珠_NC  [L0603]  43.45,11.2 180 top
FB10  1K/磁珠  [L0603]  67.02,5.15 270 top
FB11  1K/磁珠  [L0603]  62.33,5.15 270 top
FB12  1K/磁珠_NC  [L0603]  43.45,9.7 180 top
FB13  0R/800mA_NC  [L0402]  36.52,84.79 270 top
FB14  0R/800mA_NC  [R0402]  37.12,91.69 270 top
FB15  0R/800mA_NC  [L0603]  55.12,17.39 270 top
FB16  0R/800mA_NC  [L0603]  43.75,92.79 90 top
FB17  0R/800mA  [L0603]  58.93,17.33 90 top
FB18  0R/800mA  [L0603]  150.41,21.43 180 top
FB19  0R/800mA  [L0603]  43.6,16 0 top
FB20  0R/800mA  [L0603]  159.3,22.3 90 top
FB21  0R/800mA  [L0805]  43.5,17.7 0 top
FPC2  FPC-6PIN-0.5MM  [FPC-6PIN-0.5MM]  126.05,95.18 0 top
FPC3  AFC24-S24FIA-00  [FPC-SMD_P0.50-24P_QCHF-SM-H2.0]  88.5,95.24 0 top
IC1  ESP32-C6-MINI-1-N4  [ESP32C6MINI1N4]  10.91,77.32 90 top
IC2  ME6211C18M5G-N  [SOT95P282X145-5N]  105.55,86.2 180 top
IC3  ME6211C28M5G-N  [SOT95P282X145-5N]  105.54,80.5 180 top
IC4  ME6211C18M5G-N_NC  [SOT95P282X145-5N]  110.72,43.4 180 top
IC5  ES7210_NC  [QFN40P400X400X80-33N]  29.85,89.33 180 top
IC6  ES8311_NC  [QFN40P300X300X60-21N]  39.47,88.35 270 top
IC7  ME6211C33M5G-N  [SOT95P282X145-5N]  49.56,95.04 180 top
IC8  ME6211C33M5G-N  [SOT95P282X145-5N]  139.92,59.37 270 top
IC10  W25Q128JVSIQ  [SOIC127P790X216-8N]  45.28,57.05 0 top
J1  TYPEC-3.0-16P-SMD  [USB-3.0TYPEC-SMD]  170.38,62.47 90 top
J2  HY2.0-4P-SMT  [CONNECTOR_4P-SMD-2.0]  18,96.57 0 top
J3  PH2.0WT-2PIN  [PH2.0WT-2PIN]  144.93,3.11 180 top
J4  PH2.0WT-2PIN  [PH2.0WT-2PIN]  35.72,3.11 180 top
J5  [9P-SMD-W/-RING]  17.22,15.2 270 top
J6  PH2.0WT-2PIN  [PH2.0WT-2PIN]  160.93,3.11 180 top
J7  CONN_12X22X12-SMD1  [2X12-SMD1]  88.43,6.64 90 top
J8  HC-PZ200-8.7L-1X4PZ1  [TEST-PIN-4-2.0MM]  138.81,38.99 180 top
J9  [H7-2.54-18.28X2.5X5MM]  145.17,91 270 top
J10  XH2.54-4P-SMT  [XH2.54-4P-SMD]  170.73,19.8 270 top
J11  [H7-2.54-18.28X2.5X5MM]  160.67,91 270 top
J12  THO-M3.25MM-HOLE  [THO-M3.2*5MM-HOLE]  3,101 0 top
J13  HY2.0-4P-SMT  [CONNECTOR_4P-SMD-2.0]  40,96.57 0 top
J14  THO-M3.25MM-HOLE  [THO-M3.2*5MM-HOLE]  173.9,3 0 top
J15  THO-M3.25MM-HOLE  [THO-M3.2*5MM-HOLE]  173.9,101 0 top
J16  TYPEC-3.0-16P-SMD  [USB-3.0TYPEC-SMD]  170.38,41.57 90 top
J18  THO-M3.25MM-HOLE  [THO-M3.2*5MM-HOLE]  3,3 0 top
J21  C23398852_30P_0.5MM_下接_FC-05A30P11H20  [C23398852_30P_0.5MM_下接_FC-05A30P11H20]  89.6,44.51 0 top
K3  KEY-4.5X4.5  [KEY-4.5X4.5-SMD]  4.28,31.74 270 top
K4  KEY-4.5X4.5  [KEY-4.5X4.5-SMD]  4.28,17.25 90 top
L1  2.2μH_C5179446  [1008(2520)]  130.8,77.49 180 top
L2  4.7uH_C45385206_2.4A  [1008(2520)]  119.42,36.8 270 top
L3  0R  [L0603]  139.57,86.99 180 top
L4  NC  [L0603]  139.56,84.11 180 top
L5  4.7uH_C45385206_2.4A  [1008(2520)]  111.28,27.97 180 top
L6  2.2μH_C5179446  [1008(2520)]  76.83,83.03 180 top
P1  TEST_PADPAD-1.5MM  [TEST_PAD-1.5MM]  171.14,55.85 0 top
P2  TEST_PADPAD-1.5MM  [TEST_PAD-1.5MM]  167.78,63.69 0 bottom
P3  TEST_PADPAD-1.5MM  [TEST_PAD-1.5MM]  167.79,60.29 0 bottom
P4  TEST_PADPAD-1.5MM  [TEST_PAD-1.5MM]  44.7,99.69 0 bottom
P5  TEST_PADPAD-1.5MM  [TEST_PAD-1.5MM]  144.61,79.59 0 bottom
P6  TEST_PADPAD-1.5MM  [TEST_PAD-1.5MM]  15,17.7 0 top
P7  TEST_PADPAD-1.5MM  [TEST_PAD-1.5MM]  17,17.7 0 top
P8  TEST_PADPAD-1.5MM  [TEST_PAD-1.5MM]  19,17.7 0 top
P9  TEST_PADPAD-1.5MM  [TEST_PAD-1.5MM]  146.14,6.92 0 bottom
P10  TEST_PADPAD-1.5MM  [TEST_PAD-1.5MM]  174.31,55.79 0 top
P11  TEST_PADPAD-1.5MM  [TEST_PAD-1.5MM]  163.42,76.81 0 bottom
P12  TEST_PADPAD-1.5MM  [TEST_PAD-1.5MM]  6,86.5 0 top
P13  TEST_PADPAD-1.5MM  [TEST_PAD-1.5MM]  40.85,99.7 0 bottom
P14  TEST_PADPAD-1.5MM  [TEST_PAD-1.5MM]  25,17.7 0 top
P15  TEST_PADPAD-1.5MM  [TEST_PAD-1.5MM]  27,17.7 0 top
P17  TEST_PADPAD-1.5MM  [TEST_PAD-1.5MM]  19.08,99.82 0 bottom
P18  TEST_PADPAD-1.5MM  [TEST_PAD-1.5MM]  101.7,33.8 0 bottom
P19  TEST_PADPAD-1.5MM  [TEST_PAD-1.5MM]  89.68,37.41 0 bottom
P20  TEST_PADPAD-1.5MM  [TEST_PAD-1.5MM]  98.19,45.21 0 bottom
P21  TEST_PADPAD-1.5MM  [TEST_PAD-1.5MM]  11.08,86.5 90 top
P24  TEST_PADPAD-1.5MM  [TEST_PAD-1.5MM]  62.12,79.8 0 bottom
P25  TEST_PADPAD-1.5MM  [TEST_PAD-1.5MM]  8.54,86.5 90 top
P26  TEST_PADPAD-1.5MM  [TEST_PAD-1.5MM]  57.26,12.22 180 bottom
P28  TEST_PADPAD-1.5MM  [TEST_PAD-1.5MM]  143.44,6.85 0 bottom
P31  TEST_PADPAD-1.5MM  [TEST_PAD-1.5MM]  138.25,81.53 90 bottom
P32  TEST_PADPAD-1.5MM  [TEST_PAD-1.5MM]  57.27,8.32 180 bottom
P33  TEST_PADPAD-1.5MM  [TEST_PAD-1.5MM]  151.93,28.91 90 bottom
P34  TEST_PADPAD-1.5MM  [TEST_PAD-1.5MM]  147.22,29.49 90 bottom
P35  TEST_PADPAD-1.5MM  [TEST_PAD-1.5MM]  152.23,31.4 90 bottom
P36  TEST_PADPAD-1.5MM  [TEST_PAD-1.5MM]  13.62,86.5 0 top
P37  TEST_PADPAD-1.5MM  [TEST_PAD-1.5MM]  12.78,69.8 0 top
P38  TEST_PADPAD-1.5MM  [TEST_PAD-1.5MM]  16.33,99.82 0 bottom
P39  TEST_PADPAD-1.5MM  [TEST_PAD-1.5MM]  13.59,99.82 0 bottom
P53  TEST_PADPAD-1.5MM  [TEST_PAD-1.5MM]  23,17.7 0 top
P54  TEST_PADPAD-1.5MM  [TEST_PAD-1.5MM]  38,3.97 0 bottom
P55  TEST_PADPAD-1.5MM  [TEST_PAD-1.5MM]  34.56,3.86 0 bottom
P56  TEST_PADPAD-1.5MM  [TEST_PAD-1.5MM]  13,17.7 0 top
P57  TEST_PADPAD-1.5MM  [TEST_PAD-1.5MM]  21,17.7 0 top
P63  TEST_PADPAD-1.5MM  [TEST_PAD-1.5MM]  103.96,26.82 0 bottom
P64  TEST_PADPAD-1.5MM  [TEST_PAD-1.5MM]  83.92,37.43 270 bottom
P65  TEST_PADPAD-1.5MM  [TEST_PAD-1.5MM]  170.76,15.96 0 bottom
P66  TEST_PADPAD-1.5MM  [TEST_PAD-1.5MM]  170.76,18.6 0 bottom
P67  TEST_PADPAD-1.5MM  [TEST_PAD-1.5MM]  170.76,21 0 bottom
P68  TEST_PADPAD-1.5MM  [TEST_PAD-1.5MM]  170.76,23.52 0 bottom
P77  TEST_PADPAD-1.5MM  [TEST_PAD-1.5MM]  83.88,41.76 0 bottom
P87  TEST_PADPAD-1.5MM  [TEST_PAD-1.5MM]  166.75,38.26 0 top
P88  TEST_PADPAD-1.5MM  [TEST_PAD-1.5MM]  166.75,36.1 0 top
Q1  BSS138W_SOT323  [MOS_SOT323]  171.86,30.05 270 top
Q2  BSS138W_SOT323  [MOS_SOT323]  171.86,33.45 270 top
Q3  NCE20P45Q  [PDFN3333]  158.99,71.95 90 top
Q4  BSS138W_SOT323  [MOS_SOT323]  103.26,90.05 270 top
Q5  NCE20P45Q  [PDFN3333]  158.99,77.48 90 top
Q6  BSS138W_SOT323  [MOS_SOT323]  103.26,93.05 270 top
Q7  BSS138W_SOT323  [MOS_SOT323]  103.24,96.19 270 top
Q8  BSS138W_SOT323  [MOS_SOT323]  132.65,92.93 270 top
Q9  BSS138W_SOT323  [MOS_SOT323]  132.65,96.32 270 top
Q10  AO3401  [PMOS_SOT23]  62.31,24.48 90 top
Q11  AO3401_NC  [PMOS_SOT23]  115.24,22.93 0 top
R1  10K  [R0603@1]  134.88,75.74 0 top
R2  100K  [R0603@1]  134.83,81.92 270 top
R3  5.1K  [R0603@1]  166.62,63.81 0 top
R4  5.1K  [R0603@1]  166.62,60.45 180 top
R5  10K  [R0603@1]  153.23,73.2 90 top
R6  0R  [R0603@1]  156.6,65.96 0 top
R7  0R  [R0603@1]  156.6,64.53 0 top
R8  0R  [R0603@1]  145.65,67.19 0 top
R9  10K  [R0603@1]  148.87,73.25 270 top
R10  0R  [R0603@1]  145.65,68.66 0 top
R11  22.1K  [R0603]  136.33,81.92 90 top
R12  0R  [R0402]  68.06,76.7 0 top
R13  0R  [R0603@1]  79.21,85.84 270 top
R14  NC/499K  [R0603]  72.87,86.82 0 top
R15  10K  [0402]  12.56,20.17 180 top
R16  2K  [R0603-SP]  153.76,5.3 90 top
R17  5.1K  [R0603@1]  151.3,13.51 90 top
R18  10K  [R0603@1]  159.56,74.65 0 top
R19  0R  [R0402]  55.73,76.36 180 top
R20  0R  [R0402]  53.62,76.38 0 top
R21  NC/499K  [R0603]  72.89,88.26 180 top
R22  4.7K  [R0603@1]  105.45,93.08 270 top
R23  0R  [C0402]  71.05,61.9 270 top
R24  0R  [R0603@1]  76.55,91.34 180 top
R25  0R  [R0603-SP]  101.65,28.87 90 top
R26  5.1K  [R0603@1]  172.97,52 90 top
R27  10K  [0402]  14.54,20.18 180 top
R28  10K  [0402]  18.53,20.17 180 top
R29  10K  [0402]  20.54,20.17 180 top
R30  10K  [0402]  22.53,20.16 180 top
R31  2K  [R0603-SP]  167,54.86 180 top
R32  2K  [R0603-SP]  167,56.39 180 top
R33  10K_NC  [0402]  22.54,21.25 0 top
R34  22R  [0402]  21.07,68.16 90 top
R35  NC/10M  [R0402]  51.71,73.62 90 top
R36  0R  [R0402]  51.18,69.23 90 top
R37  0R  [R0402]  51.18,64.55 90 top
R38  0R  [R0402]  53.28,56.94 180 top
R39  0R  [R0402]  71.02,65.81 270 top
R40  0R  [R0402]  71.03,63.77 90 top
R41  0R  [R0402]  59.19,77.04 180 top
R42  0R  [R0402]  51.18,61.77 270 top
R43  0R  [R0402]  71.37,74.42 90 top
R44  0R  [R0402]  61.29,77 0 top
R45  4.7K  [R0603@1]  169.75,33.45 270 top
R46  4.7K  [R0603@1]  173.95,33.45 90 top
R47  5.1K  [R0603@1]  152.37,5.32 270 top
R48  22R  [0402]  138.81,91.44 180 top
R49  22R  [0402]  138.75,99.8 180 top
R50  5.1K  [R0603@1]  152.69,13.51 90 top
R51  4.7K  [R0603@1]  173.94,30.05 270 top
R52  4.7K  [R0603@1]  169.76,30.05 270 top
R53  10K  [R0603@1]  113.96,43.4 270 top
R54  10K  [R0603@1]  9.22,14.8 90 top
R55  0R  [R0603@1]  145.88,73.23 270 top
R56  4.7K  [R0603@1]  101.16,93.1 270 top
R57  4.7K  [R0603@1]  101.16,90.05 270 top
R58  4.7K  [R0603@1]  105.45,90.06 270 top
R59  4.7K  [R0603@1]  105.43,96.12 270 top
R60  0R  [R0603@1]  146.55,76.86 180 top
R61  10K  [R0603@1]  107.09,83.59 0 top
R62  4.7K  [R0603@1]  101.14,96.19 270 top
R63  100K  [R0402]  103.06,45.47 270 top
R64  100K  [R0402]  104.05,45.47 90 top
R65  0R  [R0603@1]  110.72,40.67 0 top
R66  10K  [R0603@1]  107.18,77.89 0 top
R67  10K  [R0603@1]  90.74,84.71 180 top
R68  100K  [R0402]  82.26,50.43 90 top
R69  2K  [R0603-SP]  117.71,91.56 0 top
R70  0R  [R0402]  71.45,72.47 270 top
R71  10K  [R0603@1]  64.9,24.48 90 top
R72  10K_NC  [R0402]  34.3,87.89 180 top
R73  10K_NC  [R0402]  34.3,86.94 180 top
R74  2K  [R0603@1]  117.72,93 0 top
R75  2K_NC  [R0603@1]  117.72,94.45 0 top
R76  0R  [R0603@1]  11.43,67.6 270 top
R77  10K  [R0603@1]  12.91,67.6 270 top
R78  4.7K  [R0603@1]  159.49,80.07 0 top
R79  OR_NC  [R0603-SP]  55.05,14.4 0 top
R80  0R  [R0402]  60.58,56.92 0 top
R81  51K  [0402]  18.63,69.66 0 top
R82  51K  [0402]  20.63,69.66 0 top
R83  51K  [0402]  22.63,69.66 0 top
R84  51K  [0402]  24.63,69.66 0 top
R85  51K  [0402]  26.63,69.66 0 top
R86  51K  [0402]  28.63,69.66 0 top
R87  10K  [R0603@1]  15.85,67.58 90 top
R88  0R  [R0402]  16.99,22.69 90 top
R89  0R  [R0402]  18.98,22.7 90 top
R90  0R  [R0402]  14.97,22.71 90 top
R91  10K  [R0603@1]  147.34,73.23 90 top
R92  0R  [R0402]  58.42,54.73 90 top
R93  2K  [R0603@1]  135.04,96.21 270 top
R94  2K  [R0603@1]  135.03,93.12 270 top
R95  0R  [R0402]  56.62,54.73 90 top
R96  5.1K  [R0603@1]  166.51,43.36 0 top
R97  2K  [R0603@1]  117.72,97.47 0 top
R98  2K  [R0603@1]  117.72,95.97 0 top
R99  0R  [R0402]  55.72,54.72 90 top
R100  0R  [R0402]  57.22,57.53 90 top
R101  5.1K  [R0603@1]  166.51,40.29 180 top
R102  0R  [R0402]  58.12,57.53 90 top
R103  0R  [R0603@1]  72.91,89.73 180 top
R104  4.02K  [R0402]  55.12,57.56 90 top
R105  0R  [R0402]  49.32,61.3 90 top
R106  10K  [R0603@1]  146.55,75.43 0 top
R107  0R_NC  [R0402]  48.37,61.3 90 top
R108  100K  [R0402]  83.23,50.43 270 top
R109  0R  [R0402]  64.24,76.72 0 top
R110  0R_NC  [R0402]  72.04,61.89 270 top
R111  0R_NC  [R0402]  37.36,73.5 90 top
R112  22R  [R0603@1]  63.52,17.36 270 top
R113  22R  [R0603@1]  150.36,30.36 0 top
R114  22R  [R0603@1]  150.36,31.76 0 top
R115  22R  [R0603@1]  150.36,28.96 0 top
R116  10K  [R0603@1]  143.34,62.7 0 top
R117  100K  [R0603@1]  150.38,27.53 180 top
R118  0R  [R0603@1]  138.64,41.66 90 top
R119  0R  [R0603@1]  137.24,41.66 90 top
R120  5.1K_NC  [R0603@1]  167,57.91 180 top
R121  5.1K_NC  [R0603@1]  167.01,53.41 180 top
R122  100K  [R0402]  85.28,50.43 90 top
R123  100K  [R0402]  84.31,50.43 270 top
R124  0R_NC  [R0402]  34.3,88.83 180 top
R125  0R_NC  [R0402]  34.3,89.78 180 top
R126  0R_NC  [R0402]  32.51,73.53 90 top
R127  22R  [R0402]  31.55,73.58 90 top
R128  0R_NC  [R0402]  36.35,73.5 90 top
R129  22R  [R0603@1]  64.98,17.36 270 top
R130  0R_NC  [R0402]  35.4,73.5 90 top
R131  10K  [R0402]  9.66,91.27 0 top
R132  OR  [R0402]  9.68,90.36 180 top
R133  22R  [0402]  19.08,68.12 90 top
R134  OR  [R0402]  9.68,88.52 0 top
R135  22R  [0402]  23.08,68.15 90 top
R136  22R  [0402]  25.07,68.15 90 top
R137  22R  [0402]  27.09,68.15 90 top
R138  22R  [0402]  29.08,68.15 90 top
R139  100K  [R0603@1]  61.93,17.31 90 top
R140  10K  [0402]  16.53,20.18 180 top
R141  OR_NC  [R0402]  9.61,94.07 0 top
R142  OR_NC  [R0402]  9.61,95 0 top
R143  51K  [R0603-SP]  67.95,17.36 270 top
R144  OR_NC  [R0402]  9.68,89.44 180 top
R145  OR_NC  [R0402]  9.63,93.14 0 top
R146  0R_NC  [R0402]  39.36,82.28 270 top
R147  OR_NC  [R0603-SP]  43.45,14 0 top
R148  0R_NC  [R0402]  38.44,82.28 270 top
R149  22R  [R0603@1]  66.49,17.36 270 top
R150  0R  [0402]  138.84,96.6 0 top
R151  0R  [0402]  138.84,98.32 0 top
R152  100R  [R0402]  61.76,54.75 270 top
R153  100R  [R0402]  62.61,54.75 270 top
R154  100R  [R0402]  64.54,54.75 270 top
R155  100R  [R0402]  65.42,54.75 270 top
R156  100R  [R0402]  63.97,57.45 270 top
R157  100R  [R0402]  63.07,57.45 270 top
R158  4.02K  [R0402]  65.97,57.45 270 top
R159  1.1R  [R0603-SP]  107.68,23.59 270 top
R160  10K  [R0603@1]  111.28,22.62 180 top
R161  0R_NC  [R0402]  34.42,73.52 90 top
R162  22R  [R0402]  33.45,73.51 90 top
R163  NC  [R0603-SP]  106.28,23.59 270 top
R164  39k  [R0603@1]  143.85,41.66 90 top
R165  100K  [R0603@1]  122.33,39.69 0 top
R166  180K  [R0603]  122.49,32.32 270 top
R167  12K  [R0603]  123.93,32.33 90 top
R168  1.91K  [R0402]  86.28,50.42 270 top
R169  1K  [R0402]  89.38,50.42 270 top
R170  0R_NC  [R0402]  33.39,82.89 90 top
R171  10K  [R0402]  9.63,92.21 0 top
R172  220R  [R0603]  109.98,32.96 270 top
R173  51K  [R0603@1]  106.32,32.96 90 top
R174  220R  [R0603]  110.13,37.47 270 top
R175  51K  [R0603@1]  106.32,37.47 90 top
R177  0R_NC  [R0402]  32.43,82.9 90 top
R178  20K_NC  [R0603]  55,8.2 0 top
R179  20K_NC  [R0603]  43.45,8.2 180 top
R180  10K  [R0603@1]  115.24,20.4 0 top
R181  10K  [R0603@1]  52.64,95.03 270 top
R182  0R  [L0805]  6.21,96.22 270 top
R184  0R  [R0603@1]  117.64,22.99 90 top
R185  OR_NC  [R0603-SP]  43.45,5.1 0 top
R186  100k  [R0603@1]  141.52,41.66 270 top
R187  10k  [R0603@1]  139.02,54.18 270 top
R188  0R  [R0603@1]  142.11,54.23 270 top
R189  0R  [R0603@1]  143.64,54.23 270 top
R190  0R  [R0402]  59.31,54.73 90 top
R210  NC/10K  [R0603@1]  79.22,88.8 270 top
R216  0R  [0402]  138.79,92.58 0 top
R217  0R  [0402]  138.81,95.24 0 top
R332  0R  [0402]  138.79,93.85 0 top
R333  10K  [R0402]  43.83,61.3 90 top
SW1  switch_6pin  [SWITCH_6PIN_2P]  172.09,79.45 90 top
U1  CH340K  [ESOP-10-EP-150MIL]  151.17,68.27 180 top
U2  TP4059-SOT23-6  [SOT23-6L]  152.32,9.3 180 top
U3  NS4168  [NS4168-ESOP-8]  154.89,28.22 270 top
U4  NS4263B  [SOP16]  46.5,14.3 270 top
U6  MT9201  [COOPER_SOT23-6]  111.28,25.13 270 top
U7  ESP32-P4NRW32  [IC_ESP32-P4NRW32]  60.03,67.41 0 top
U8  UMH3NTN  [SOP65P210X100-6N]  151.09,73.27 90 top
U9  MT3406_C22462728  [SOT95P280X145-5N]  134.94,78.26 0 top
U10  MT3406_C22462728  [SOT95P280X145-5N]  76.51,86.82 90 top
U13  NS4168  [NS4168-ESOP-8]  64.56,11.22 270 top
U14  STC8H1K08-36I  [TSSOP20]  140.81,48.1 270 top
U16  MT3608  [SOT95P280X145-6N]  122.3,36.75 90 top
U176  LMA3526B381  [MIC-SMD_5P-L3.5-W2.7-P1.67]  3.04,92.12 270 top
U$113  [P4-LCD-7.0-BK3]  0,0 0 top
Y2  40MHZ  [X322540MPB4SI]  55.63,80.37 0 top
Y3  24Mhz  [24MHZ_1631-24003-BTKEYA]  90.76,87.67 90 top
Y4  32.768K  [NORDIC_NRF_XTAL_3215_N]  49.15,73.87 270 top

## Tracks (layer width: path | path; a pad name or v marks a point on that pad's centre or on a via)
3V3$
  Top 0.406: C2.2 146.99,66.27 U1.10
13
  Top 0.12: R189.2 142.14,51.97 141.78,51.62 U14.3
14
  Top 0.12: U14.4 141.13,52.48 R188.2
+5V_IN  (via drill 0.4 pad 0.8)
  Top 0.305: R51.1 172.11,30.81 171.8,30.5 171.8,28.8 171.4,28.4 166.26,28.4 165.76,28.89
  Top 0.406: R46.1 R51.1
  Top 0.813: J10.3 168.9,18.6 v172.32,18.6
  Top 2: J10.3 164.55,18.55 163.93,19.17 163.93,28.76 D4.+ 165.76,28.89 D2.+
  Bottom 0.813: P66.P$1 v172.32,18.6
+VBUS1  (via drill 0.35)
  Top 0.305: J1.B4 168.38,64.72 168.1,65 | 168,65.1 168.08,65.02 J1.A9 170.91,65.02 171.72,64.22 | J1.B4 | J1.B4 170.81,64.72 171.32,64.22 171.47,64.22 171.72,64.22 | J1.B9 170.82,60.22 171.26,60.67 171.26,61.13 171.4,60.99 171.43,60.96 171.59,60.8 170.71,59.92 J1.A4 | 171.72,64.22 171.8,64.13
  Top 0.508: 171.8,63.76 171.47,64.09 171.47,64.22
  Top 0.61: 171.8,64.13 171.8,63.76 v171.8,61.22 171.69,61.22 171.43,60.96
  Top 0.762: v173.02,56.84 172.03,55.85 P1.P$1
  Top 1: 168,65.1 168.1,65
  Bottom 0.762: v171.8,61.22 173.02,59.99 v173.02,56.84
  pour Top (no thermals): 165.49,64.61 168.28,64.61 168.48,64.8 168.48,66.04 168.35,66.17 165.55,66.17 165.42,66.04 165.36,65.97 165.36,64.67 165.42,64.61
+VBUS2  (via drill 0.35)
  Top 0.305: J16.B4 168.88,43.82 168.72,43.98 168.58,44.12 J16.A9 170.96,44.12 171.5,43.58 171.5,43.4 171.4,43.3 170.88,43.82 J16.B4 | J16.B4 168.66,43.82 168,44.48 | 171.4,39.6 171.3,39.6 171.02,39.32 | 171.02,39.32 171.32,39.32 171.02,39.02 J16.A4 | 171.02,39.32 J16.B9
  Top 0.61: 171.4,43.3 171.5,43.2 v171.5,40.86 171.5,39.7 171.4,39.6 | 168.72,43.98 168.56,43.98 D007.+
  Top 0.762: P87.P$1 v168.01,38.26
  Bottom 0.762: v171.5,40.86 171.5,40.61 169.15,38.26 v168.01,38.26
  pour Top (no thermals): 165.36,44.33 168.15,44.33 168.35,44.52 168.35,45.76 168.22,45.89 165.42,45.89 165.29,45.76 165.23,45.69 165.23,44.39 165.29,44.33
ADC_AVDD_3V3
  Top 0.203: IC5.23 27.13,88.33 27.1,88.36 27.47,88.73 IC5.22
  Top 0.508: FB5.2 25.41,87.09 C133.2 C132.1 26.77,88.03 27.1,88.36
ADC_DVDD_3V3
  Top 0.203: IC5.7 32.61,90.33 32.64,90.3 32.27,89.93 IC5.6
  Top 0.254: 35.73,90.69 36.14,90.28 36.14,87.17 35.76,86.8 34.89,86.8 R73.1 | C130.1 33.87,91.22
  Top 0.381: 33.64,91.27 33.61,91.27 32.64,90.3
  Top 0.406: C130.1 33.64,91.27
  Top 0.508: C131.2 33.89,91.29 C130.1 | 35.73,90.69 35.28,91.14 C131.2 | FB4.2 C131.2
ADC_VBAT
  Top 0.152: 140.16,42.42 C158.2
  Top 0.406: R164.2 R186.1 140.16,42.42 | C158.2 138.59,43.87 U14.13
AGND  (via drill 0.3 pad 0.6)
  Top 0.508: J4.P$4 v34.09,8.81 v34.1,8.8
  other vias: 37.7,8.8 42.6,4.1 48.1,6.4 55.9,4.1 53.3,12.9 45.2,12.9 45.4,16 45.6,17.8 57,14.4 63.4,11.9 64.5,11.9 65.7,11.9 63.4,11 64.6,11 65.7,11 58.8,15.1 65.2,7.1 63.6,7.1 64.4,7.1 67.9,19.2 60.4,19.1 53.6,19.3 52.1,19.3 50.8,19.4 58.9,11.4 68.2,14.4 68.2,8.1 60,6.6 48.8,3.5 33,5.9 33.9,11.8 40.5,11.9 69.09,17.45 67.95,12.37 45.6,19.32 47.25,19.45 47.25,17.8 47.25,16.02
  pour Bottom (rank 2, no thermals): 31.4,2.9 31.4,10.8 33.7,13.1 41.2,13.1 43.7,15.6 43.7,18.6 45,19.9 68.8,19.9 69.6,19.1 69.6,7.7 66.9,5 61.1,5 57.9,1.8 42.2,1.8 41.7,1.3 33,1.3
  pour Top (rank 2, no thermals): 43.7,15.6 43.7,18.6 45,19.9 68.7,19.9 69.6,19 69.6,7.7 66.9,5 61.2,5 58,1.8 42.2,1.8 41.7,1.3 33,1.3 31.4,2.9 31.4,10.9 33.6,13.1 41.2,13.1
AGND1  (via drill 0.3, 0.3 pad 0.6, 0.35)  (1 unrouted)
  Top 0.12: R145.2 10.08,93.01 v10.92,92.16 | IC5.21 27.83,89.14 26.78,89.14 v26.39,88.74
  Top 0.2: IC6.10 v37.97,86.8 v37.98,86.79
  Top 0.508: U176.5_2 1.66,91.94 2.4,91.2 v2.4,90.5
  other vias: 4.68,88.48 12.37,91.74 23.69,91.42 23.69,90.52 23.69,88.32 23.69,87.35 26.16,83.5 27.06,83.5 28.06,83.5 29.16,83.5 3.89,89.61 12.35,88.77 18.21,91.62 20.56,89.28 12.17,95.37 7.42,94.95 3.9,95 5.53,90.81 2.4,88.5 24.65,84.82 39.75,80.77 5.26,94.19 6.28,94.19 4.88,95.21 4.41,94.24 40.27,83.37 41.28,83.37 37.47,83.5 36.71,80.7 33.03,80.83 28.58,81.08 22.23,92.26 26.68,87.18 26.17,92.77 23.24,93.34 14.78,91.49 14.27,93.78 20.5,93.27 17.32,93.52 14.66,88.82 17.2,88.7 27.19,91.5 10.96,89.54
  pour Top (no thermals): 3.24,95.93 13.09,95.93 15.26,93.76 26.28,93.76 27.74,92.31 27.52,87.08 42.75,86.97 42.75,83.13 39.46,79.84 27.79,79.84 19.55,88.09 1.41,88.09 0.76,88.73 0.76,93.45
  pour Bottom (no thermals): 3.24,95.93 13.09,95.93 15.26,93.76 26.15,93.76 27.74,92.18 27.52,87.08 42.75,86.97 42.75,83.13 39.46,79.84 27.79,79.84 19.55,88.09 1.41,88.09 0.76,88.73 0.76,93.45
AGND2  (via drill 0.3 pad 0.6)
  other vias: 172.6,98
AGND3  (via drill 0.3 pad 0.6)
  Top 0.127: U3.9 v154.89,28.89 v154.9,28.9
  Top 0.508: v159.3,24.1 FB20.2 | C68.1 v154.4,24 | C67.1 155.5,23.33 v155.5,24 155.52,24.02 U3.7 155.52,27.12 v156,27.6 | v148.9,25.6 148.94,25.64 C24.2 C23.2 | C23.2 148.94,24.24 v148.9,24.2 | C23.2 C22.2 v149.01,22.81 v149,22.8 | v158.9,9.5 158.27,9.5 J6.P$4 158.29,8.81 v159,8.1 | v162.9,9.5 163.59,8.81 J6.P$3 163.61,8.81 v163,8.2
  Top 0.61: C68.1 C67.1
  other vias: 153.8,28.9 156,28.9 153.8,27.6 154.9,27.6
  pour Bottom (no thermals): 157.1,29.8 153.7,29.8 150.5,26.6 148.5,26.6 148,26.1 148,21.9 148.3,21.6 152.88,21.6 158.2,16.28 158.2,7.5 158.9,6.8 163.6,6.8 164,7.2 164,14.18 158.6,19.58 158.6,28.3
  pour Top (no thermals): 148.12,21.25 148.12,30.74 150.28,32.9 156.7,32.9 157.8,31.8 157.8,29.1 159.8,27.1 159.8,22.6 159.5,22.3 158.7,22.3 158.5,22.1 158.5,21.3 158.6,21.2 158.6,19.7 164.06,14.24 164.06,11.84 165.4,10.5 165.4,7 164.8,6.4 156.7,6.4 156.1,7 156.1,10.1 158.2,12.2 158.2,16.32 154.12,20.4 148.97,20.4
AUDIO_CTRL  (via drill 0.35)
  Top 0.12: v79.34,21.69 79.97,21.05 79.98,21.05 83.61,17.43 107.6,17.43 114.87,10.16 133.75,10.16 137.22,13.63 137.22,27.7 v137.09,27.83 | v148.46,27.25 149.34,27.25 R117.2
  Top 0.127: 61.9,18.1 R139.2 61.93,21.15 v61.38,21.7 61.29,21.79 Q10.3
  Bottom 0.12: v79.34,21.69 79.33,21.7 v61.38,21.7 | v137.09,27.83 137.29,28.03 147.8,28.03 148.46,27.37 v148.46,27.25
AUDIO_OUT_5V  (via drill 0.3 pad 0.6)
  Top 0.61: 53.63,16.63 C148.2 53.67,16.63 | U4.4 v47.9,10.5 | v50.3,10.55 50.36,10.49 U4.13
  Top 0.813: 53.63,16.63 C134.2 C154.1 50.48,16.36 50.48,10.73 v50.3,10.55 | FB15.2 53.67,16.63
  Bottom 0.61: v50.3,10.55 50.25,10.5 v47.9,10.5 47.9,11.1 v48,11.2 50.18,11.2 v50.25,11.27
  pour Bottom: 47.7,11.5 49.5,11.5 49.7,11.7 49.8,11.8 50.3,11.8 50.6,11.5 50.8,11.3 50.8,10.7 50.1,10 47.8,10 47.4,10.4 47.4,11.3 47.6,11.5
  pour Top (no thermals): 46.5,10.8 47.2,10.8 47.3,10.9 47.5,11.1 47.5,11.4 47.8,11.7 47.9,11.7 48.3,11.7 48.5,11.5 48.5,11.4 48.5,10.5 48.4,10.4 48.1,10.1 47.1,10.1 46.5,10.1 46.3,10.3 46.3,10.6
AUDIO_OUT_SD  (via drill 0.3 pad 0.6, 0.35)
  Top 0.12: U7.60 66.19,65.49 66.7,64.98 66.7,61.31 69.26,58.75 73.81,58.75 78.19,63.13 127.31,63.13 128.75,61.7 128.75,36.67 131.92,33.5 137.87,33.5 139.57,31.79 139.57,13.18 134.35,7.95 113.63,7.95 106.02,15.56 81.5,15.56 v74.76,22.3 | 42.69,14.09 R147.1 41.24,14 40.51,14.73 40.51,19.18 43.43,22.1 v46.48,22.1
  Top 0.127: v63.27,22.37 63.32,22.41 Q10.1 63.45,23.72 R71.1
  Bottom 0.12: v74.76,22.3 74.72,22.35 63.29,22.35 | v46.48,22.1 46.74,22.37 v63.27,22.37
  Bottom 0.127: v63.27,22.37 63.29,22.35
AUDIO_VDD1
  Top 0.508: C104.1 60.43,16.49 | 61.6,9.7 63.1,9.7 63.92,8.87 U13.6
  Top 0.813: FB17.1 C104.1 | 60.43,16.49 C102.1 C103.1 60.43,10.87 61.6,9.7
AUDIO_VDD2
  Top 0.508: C24.1 151.17,25.77 | 152.1,26.7 153.8,26.7 154.25,26.24 U3.6
  Top 0.6: C23.1 C24.1
  Top 0.8: FB18.1 C22.1 C23.1 | 151.17,25.77 152.1,26.7
AUDIO_VDD_3V3  (via drill 0.3 pad 0.6, 0.35)
  Top 0.381: FB6.1 7.45,87.74 16.59,87.74 v17.63,86.7
  Top 0.508: v23.16,86.4 23.35,86.21 FB5.1 | FB4.1 36.22,92.13 FB14.1 | 37.53,93.28 34.92,95.88 28.07,95.88 25.91,93.73 24.89,93.73 v22.86,91.69
  Top 0.61: C153.2 44.07,93.55 FB16.2 | v17.63,86.7 17.63,86.69 v18.47,86.69
  Top 0.762: 44.07,93.55 37.8,93.55 37.53,93.28 37.08,92.84 37.08,92.17 FB14.1
  Bottom 0.508: v23.16,86.4 22.85,86.7 v17.63,86.7 | v22.86,91.69 22.86,87.1 v23.76,86.2
  Bottom 0.61: v23.16,86.4 23.36,86.2 v23.76,86.2
  pour Top (no thermals): 43.31,93.09 47.52,93.09 arc45 47.7,93.16 48.06,93.52 arc-45 48.24,93.6 48.89,93.6 48.95,93.65 arc45 49.02,93.83 49.02,94.36 48.97,94.41 arc45 48.79,94.49 46.21,94.49 arc45 46.03,94.41 45.97,94.36 43.28,94.36 arc45 43.11,94.29 43.05,94.23 43.05,93.32 arc45 43.13,93.14
AVDD_2V8  (via drill 0.35)
  Top 0.3: FPC3.2 93.75,94.38 | FPC3.1 94.25,94.34
  Top 0.508: v97.41,84.45 v97.41,83.69 97.41,81.44 99.11,79.74 C83.2
  Top 0.61: IC3.5 102.69,79.55 C82.2 C83.2
  Bottom 0.508: v97.41,83.69 97.41,92.58 96.52,93.47 95.25,93.47 v95,93.22 v95,93.98
  pour Top (no thermals): 93.73,92.84 95.27,92.84 arc45 95.45,92.91 95.5,92.96 95.56,93.02 arc45 95.63,93.2 95.63,94.36 95.45,94.54 arc45 95.27,94.61 94.87,94.61 93.96,94.61 arc45 93.78,94.54 93.73,94.49
C6_EN  (via drill 0.35)
  Top 0.12: U7.63 65.97,66.54 66.18,66.75 66.71,66.75 67.23,66.23 67.23,61.41 69.26,59.37 73.23,59.37 77.71,63.86 127.73,63.86 129.54,62.04 129.54,37.34 132.46,34.42 138.15,34.42 140.65,31.92 140.65,13.14 134.47,6.96 112.57,6.96 104.37,15.16 80.9,15.16 74.14,21.92 74.14,25.36 70.93,28.57 64.52,28.57 46.23,46.86 v46.23,46.88 | 13.08,68.36 C15.1 15.11,67.64 15.11,65.02 16.64,63.5 28.07,63.5 33.15,58.42 v33.15,50.29 | 13.08,68.36 R77.1 | IC1.8 12.51,70.07 P37.P$1 12.78,68.67 13.08,68.36
  Bottom 0.12: v46.23,46.88 36.56,46.88 v33.15,50.29
C6_IO8
  Top 0.12: 16.64,69.6 16.64,69.1 15.91,68.37
  Top 0.152: IC1.22 16.3,80.52 16.64,80.19 16.64,69.6 | 15.91,68.37 R87.2
C6_IO9_BOOT  (via drill 0.35)
  Top 0.12: P36.P$1 12.59,85.47 v12.06,85.47
  Top 0.152: IC1.23 15.2,81.32 v14.73,81.79
  Bottom 0.12: v12.06,85.47 12.06,82.8 12.32,82.55 13.94,82.55 14.7,81.79 v14.73,81.79
C6_RXD0
  Top 0.12: P21.P$1 11.08,83.39 IC1.30
C6_SD2_CLK
  Top 0.152: IC1.25 14.91,83.7 15.08,83.87 arc-45 15.26,83.94 16.39,83.94 arc-45 16.96,83.7 21,79.66 arc-45 21.07,79.48 21.07,77.67 arc90 21.27,77.47 21.39,77.47 arc-90 21.59,77.27 21.59,77.22 arc-90 21.39,77.02 20.75,77.02 arc90 20.55,76.82 20.55,76.78 arc90 20.75,76.57 21.39,76.57 arc-90 21.59,76.37 21.59,76.33 arc-90 21.39,76.13 20.75,76.13 arc90 20.55,75.92 20.55,75.88 arc90 20.75,75.68 21.39,75.68 arc-90 21.59,75.47 21.59,75.43 arc-90 21.39,75.23 20.75,75.23 arc90 20.55,75.03 20.55,74.98 arc90 20.75,74.78 21.39,74.78 arc-90 21.59,74.58 21.59,74.54 arc-90 21.39,74.33 20.75,74.33 arc90 20.55,74.13 20.55,74.09 arc90 20.75,73.88 21.39,73.88 arc-90 21.59,73.68 21.59,73.64 arc-90 21.39,73.44 20.75,73.44 arc90 20.55,73.23 20.55,73.19 arc90 20.75,72.99 21.39,72.99 arc-90 21.59,72.78 21.59,72.74 arc-90 21.39,72.54 21.27,72.54 arc90 21.07,72.34 C25.2 R82.2 R34.2
C6_SD2_CMD
  Top 0.152: R133.2 R81.2 C160.2 19.07,71.79 arc90 18.87,71.99 18.25,71.99 arc-90 18.04,72.2 18.04,72.25 arc-90 18.25,72.45 18.87,72.45 arc90 19.07,72.65 19.07,72.71 arc90 18.87,72.91 18.25,72.91 arc-90 18.04,73.11 18.04,73.16 arc-90 18.25,73.37 18.87,73.37 arc90 19.07,73.57 19.07,73.62 arc90 18.87,73.83 18.25,73.83 arc-90 18.04,74.03 18.04,74.08 arc-90 18.25,74.28 18.87,74.28 arc90 19.07,74.49 19.07,74.54 arc90 18.87,74.74 18.25,74.74 arc-90 18.04,74.95 18.04,75 arc-90 18.25,75.2 18.87,75.2 arc90 19.07,75.4 19.07,75.46 arc90 18.87,75.66 18.25,75.66 arc-90 18.04,75.86 18.04,75.91 arc-90 18.25,76.12 18.87,76.12 arc90 19.07,76.32 19.07,76.37 arc90 18.87,76.58 18.25,76.58 arc-90 18.04,76.78 18.04,76.83 arc-90 18.25,77.03 18.87,77.03 arc90 19.07,77.24 19.07,77.29 arc90 18.87,77.49 18.25,77.49 arc-90 18.04,77.69 18.04,77.75 arc-90 18.25,77.95 18.87,77.95 arc90 19.07,78.15 19.07,78.21 arc90 18.87,78.41 18.25,78.41 arc-90 18.04,78.61 18.04,78.66 arc-90 18.25,78.87 18.87,78.87 arc90 19.07,79.07 19.07,79.44 arc45 19,79.62 16.5,82.12 IC1.24
C6_SD2_D0
  Top 0.152: IC1.26 14.11,83.69 14.62,84.2 arc-45 14.95,84.34 17.72,84.34 arc-45 18.47,84.03 22.86,79.64 arc-45 23.08,79.1 23.08,75.54 arc90 23.28,75.34 23.85,75.34 arc-90 24.06,75.13 24.06,75.09 arc-90 23.85,74.88 23.28,74.88 arc90 23.08,74.68 23.08,74.63 arc90 23.28,74.43 23.85,74.43 arc-90 24.06,74.22 24.06,74.18 arc-90 23.85,73.97 23.28,73.97 arc90 23.08,73.77 23.08,73.72 arc90 23.28,73.52 23.85,73.52 arc-90 24.06,73.32 24.06,73.27 arc-90 23.85,73.07 23.28,73.07 arc90 23.08,72.86 23.08,72.81 arc90 23.28,72.61 23.85,72.61 arc-90 24.06,72.41 24.06,72.36 arc-90 23.85,72.16 23.28,72.16 arc90 23.08,71.95 23.08,70.67 C161.2 R83.2 R135.2
C6_SD2_D1
  Top 0.152: IC1.27 13.31,83.61 14.19,84.49 arc-45 14.62,84.67 18.13,84.67 arc-45 18.77,84.4 24.62,78.56 arc-45 25.04,77.53 25.04,74.7 arc90 25.24,74.5 25.71,74.5 arc-90 25.91,74.29 25.91,74.21 arc-90 25.71,74 25.24,74 arc90 25.04,73.8 25.04,73.71 arc90 25.24,73.51 25.71,73.51 arc-90 25.91,73.31 25.91,73.22 arc-90 25.71,73.01 25.24,73.01 arc90 25.04,72.81 25.04,72.72 arc90 25.24,72.52 25.71,72.52 arc-90 25.91,72.32 25.91,72.23 arc-90 25.71,72.03 25.24,72.03 arc90 25.04,71.82 25.04,70.69 C162.2 R84.2 R136.2
C6_SD2_D2
  Top 0.152: IC1.28 12.51,83.65 13.66,84.8 arc-45 14.13,85 18.39,85 arc-45 19.24,84.65 25.51,78.37 arc-45 27.07,74.61 27.07,74.17 arc90 27.27,73.96 27.5,73.96 arc-90 27.85,73.62 arc-90 27.53,73.31 27.27,73.31 arc90 27.07,73.1 27.07,72.85 arc90 27.27,72.65 27.55,72.65 arc-90 27.76,72.44 27.76,72.17 arc-90 27.58,71.99 27.27,71.99 arc90 27.07,71.79 C163.2 R85.2 27.09,69.65 R137.2
C6_SD2_D3
  Top 0.152: IC1.29 11.71,83.61 13.13,85.04 arc-45 13.82,85.32 18.74,85.32 arc-45 19.74,84.91 25.72,78.92 arc-45 29.07,70.84 C164.2 29.07,69.72 | R86.2 29.07,69.72 | R138.2 29.08,69.72 29.07,69.72
C6_TXD0
  Top 0.12: P25.P$1 10.11,84.93 IC1.31
C6_VDD_3V3  (via drill 0.3, 0.35)
  Top 0.381: R76.1 12.91,66.88 R77.2 12.91,65.83 v12.95,65.79 | v15.75,65.79 15.85,65.89 15.85,66.57 | 15.85,66.57 R87.1 | v18.19,68.91 15.85,66.57
  Top 0.508: IC1.3 8.51,68.41 C11.1 | R86.1 v28.18,68.92 v28.17,68.91 | R85.1 26.18,68.92 v26.19,68.91 | R84.1 v24.18,68.91 | v22.17,68.91 R83.1 | R82.1 v20.18,68.92 v20.17,68.91 | v18.19,68.91 18.18,68.92 R81.1
  Top 0.762: R76.1 C14.2 C11.1
  Bottom 0.381: v12.95,65.79 v15.75,65.79
  Bottom 0.508: v28.17,68.91 v26.19,68.91 v24.18,68.91 v22.17,68.91 v20.17,68.91 v18.19,68.91
CODEC_3V3
  Top 0.152: IC6.4 39.01,89.91 39.01,90.69 39.47,90.23 IC6.3
  Top 0.2: 36.34,84.34 FB13.2
  Top 0.254: FB14.2 37.12,90.66 36.52,90.07 36.52,86.97 35.89,86.33 35.89,84.92 36.34,84.47 36.34,84.34
  Top 0.406: FB14.2 | FB14.2 C145.1 39,91.25 C146.2
  Top 0.508: C146.2 39.01,90.69
CSI_CLK_N  (via drill 0.2, 0.35)
  Top 0.12: v85.15,74.17 85.39,74.41 85.39,92.2 85.25,92.34 FPC3.19 85.25,94.39 | R156.2 63.63,56.67 63.63,53.39 64.44,52.58 74.32,52.58 79.9,58.16 84.48,58.16 v84.67,58.36
  Bottom 0.12: v84.67,58.36 84.77,58.36 84.93,58.2 85.18,58.2 85.43,58.45 85.43,73.89 v85.15,74.17
CSI_CLK_P  (via drill 0.2, 0.35)
  Top 0.12: v85.85,74.17 85.61,74.41 85.61,92.2 85.75,92.34 FPC3.18 85.75,94.42 | R157.2 63.41,56.67 63.41,53.27 64.35,52.33 74.39,52.33 79.97,57.92 84.52,57.92 v84.66,57.78
  Bottom 0.12: v84.66,57.78 84.85,57.98 85.27,57.98 85.65,58.36 85.65,73.96 v85.85,74.17
CSI_D0_N  (via drill 0.2, 0.35)
  Top 0.12: v86.65,73.45 86.89,73.69 86.89,92.2 86.75,92.34 FPC3.16 86.75,94.4 | R152.2 62.07,53.99 62.07,53.27 63.9,51.44 74.79,51.44 80.12,56.77 87.71,56.77 v87.83,56.64
  Bottom 0.12: v86.65,73.45 86.65,73.43 86.87,73.2 86.87,57.04 87.16,56.76 87.72,56.76 v87.83,56.64
CSI_D0_P  (via drill 0.2, 0.35)
  Top 0.12: FPC3.15 87.25,92.34 87.11,92.2 87.11,73.69 v87.35,73.45 | R153.2 62.29,53.99 62.29,53.36 64,51.66 74.7,51.66 80.06,57.02 87.63,57.02 87.81,57.2 v87.83,57.2